# EAGLE design telecommandeB (EAGLE 8.0.2)
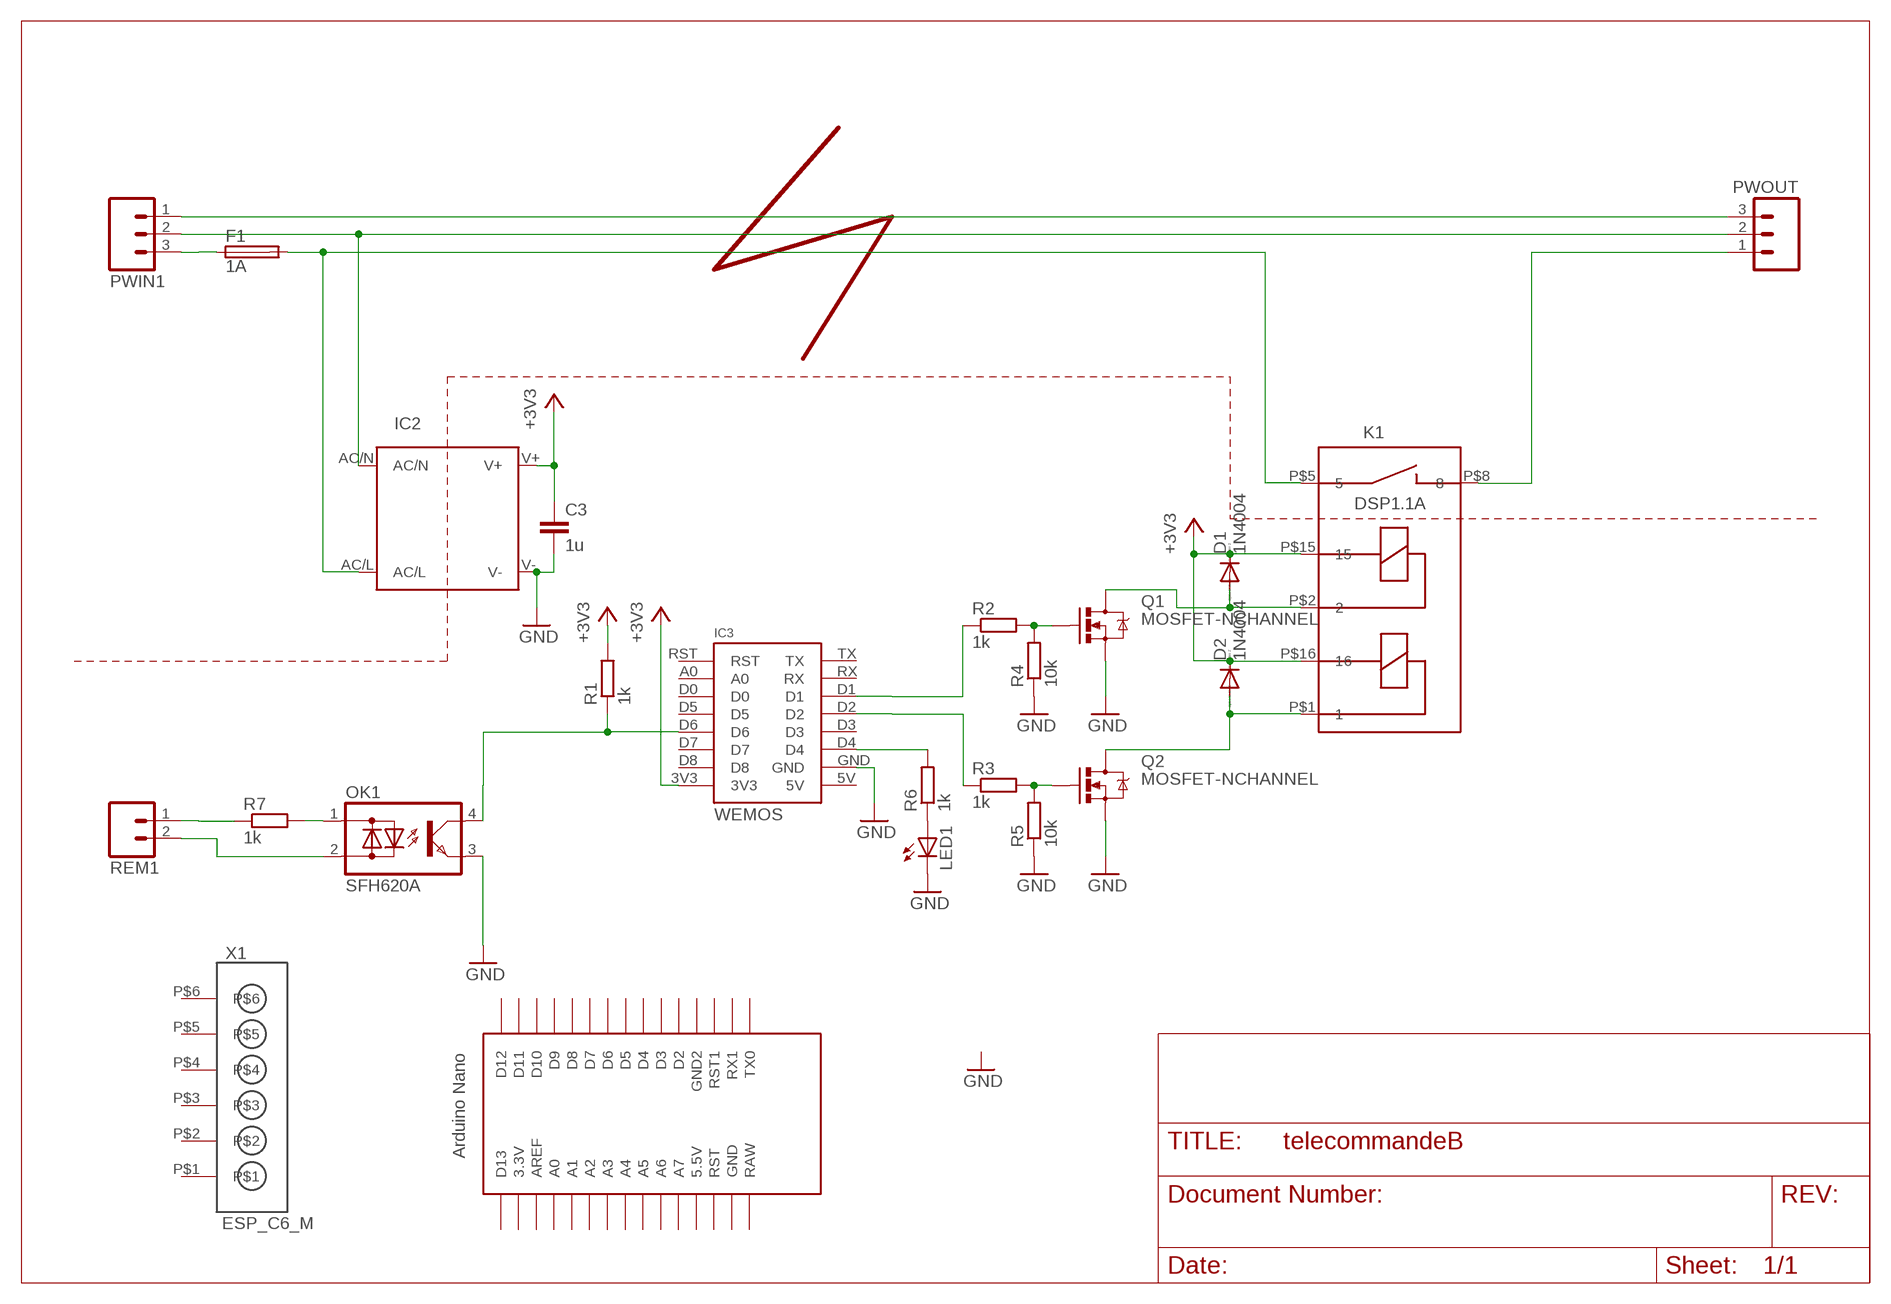
[diagram p0: schematic, sheet 1]

## Parts
C3  1u  C-EU025-024X044  [C025-024X044]
D1  1N4004  [DO41-10]
D2  1N4004  [DO41-10]
F1  1A  GSH15  [GSH15]
IC2  IRM_03  [IRM_03]
IC3  WEMOS  [WEMOS]
K1  DSP1.1A  [DSP1A]
LED1  LED3MM  [LED3MM]
OK1  SFH620A  [DIL04]
PWIN1  M03-SCREW-5MM  [SCREWTERMINAL-5MM-3]
PWOUT  M03-SCREW-5MM  [SCREWTERMINAL-5MM-3]
Q1  MOSFET-NCHANNEL  [TO-92-L]
Q2  MOSFET-NCHANNEL  [TO-92-L]
R1  1k  R-EU_0207/10  [0207/10]
R2  1k  R-EU_0204/7  [0204/7]
R3  1k  R-EU_0204/7  [0204/7]
R4  10k  R-EU_0204/7  [0204/7]
R5  10k  R-EU_0204/7  [0204/7]
R6  1k  R-EU_0204/7  [0204/7]
R7  1k  R-EU_0207/10  [0207/10]
REM1  M025MM  [SCREWTERMINAL-5MM-2]
U$1  NANO  [NANO]
X1  ESP_C6_M  [ESP-CONNECT-6]

## Nets
+3V3: C3.1 D1.C D2.C IC2.V+ IC3.3V3 K1.P$15 K1.P$16 R1.2
GND: C3.2 IC2.V- IC3.GND LED1.K(C) OK1.3(E) Q1.P$1(S) Q2.P$1(S) R4.1 R5.1
MASSE [240V]: PWIN1.1 PWOUT.3
N [240V]: IC2.AC/N PWIN1.2 PWOUT.2
N$1: Q1.P$2(G) R2.2 R4.2
N$2: Q2.P$2(G) R3.2 R5.2
N$3: D1.A K1.P$2 Q1.P$3(D)
N$4: IC3.D4 R6.2
N$6: D2.A K1.P$1 Q2.P$3(D)
N$8 [240V]: K1.P$8 PWOUT.1
N$9: R7.1 REM1.1
N$10: LED1.A R6.1
N$11: OK1.1(AC1) R7.2
N$12: IC3.D1 R2.1
N$13: IC3.D2 R3.1
N$15: OK1.2(AC2) REM1.2
N$16: IC3.D6 OK1.4(C) R1.1
P [240V]: F1.2 IC2.AC/L K1.P$5
PI [240V]: F1.1 PWIN1.3
Unconnected: IC3.5V IC3.A0 IC3.D0 IC3.D3 IC3.D5 IC3.D7 IC3.D8 IC3.RST IC3.RX IC3.TX U$1.3.3V U$1.5V(5.5V) U$1.A0 U$1.A1 U$1.A2 U$1.A3 U$1.A4 U$1.A5 U$1.A6 U$1.A7 U$1.AREF U$1.D2 U$1.D3 U$1.D4 U$1.D5 U$1.D6 U$1.D7 U$1.D8 U$1.D9 U$1.D10 U$1.D11 U$1.D12 U$1.D13 U$1.GND U$1.GND1(GND2) U$1.ICSP1 U$1.ICSP2 U$1.ICSP3 U$1.ICSP4 U$1.ICSP5 U$1.ICSP6 U$1.RAW U$1.RST U$1.RST1 U$1.RX1 U$1.TX0 X1.P$1 X1.P$2 X1.P$3 X1.P$4 X1.P$5 X1.P$6

## Library data of the parts
C3 = rcl:C-EU: CAPACITOR, European symbol
D1 D2 = diode:1N4004: DIODE general purpose rectifier, 1 A
F1 = fuse:GSH15: FUSE HOLDER grid 15mm, 19649 Wickmann; MPN: 64900001039; OC_FARNELL: 1271673; OC_NEWARK: 02P0318
IC2 = meanwell_irm_v6:IRM_03: 3 watt IRM 03 Vout [V] Imax [A] Pmax [W] Eff [%] 3.3 0.9 3 68 5 0.6 3 72 9 0.33 3 77 12 0.25 3 78 15 0.2 3 78 24 0.125 3 80
IC3 = wemos:WEMOS
K1 = nicolas:DSP1.1
LED1 = led:LED: LED OSRAM: - CHIPLED LG R971, LG N971, LY N971, LG Q971, LY Q971, LO R971, LY R971 LH N974, LH R974 LS Q976, LO Q976, LY Q976 LO Q996 - Hyper CHIPLED LW Q18S LB Q993, LB Q99A, LB R99A - SideLED LS A670, LO A670, LY A670, LG A670, LP A670 LB A673, LV A673, LT A673, LW A673 LH A674 LY A675 LS A676, LA A676, LO A676, LY A676, LW A676 LS A679, LY A679, LG A679 - Hyper Micro SIDELED® LS Y876, LA Y876, LO Y876, LY Y876 LT Y87S - SmartLED LW L88C, LW L88S LB L89C, LB L89S, LG L890 LS L89K, LO L89K, LY L89K LS L896, LA L896, LO L896, LY L896 - TOPLED LS T670, LO T670, LY T670, LG T670, LP T670 LSG T670, LSP T670, LSY T670, LOP T670, LYG T670 LG T671, LOG T671, LSG T671 LB T673, LV T673, LT T673, LW T673 LH T674 LS T676, LA T676, LO T676, LY T676, LB T676, LH T676, LSB T676, LW T676 LB T67C, LV T67C, LT T67C, LS T67K, LO T67K, LY T67K, LW E67C LS E67B, LA E67B, LO E67B, LY E67B, LB E67C, LV E67C, LT E67C LW T67C LS T679, LY T679, LG T679 LS T770, LO T770, LY T770, LG T770, LP T770 LB T773, LV T773, LT T773, LW T773 LH T774 LS E675, LA E675, LY E675, LS T675 LS T776, LA T776, LO T776, LY T776, LB T776 LHGB T686 LT T68C, LB T68C - Hyper Mini TOPLED® LB M676 - Mini TOPLED Santana® LG M470 LS M47K, LO M47K, LY M47K Source: http://www.osram.convergy.de LUXEON: - LUMILED® LXK2-PW12-R00, LXK2-PW12-S00, LXK2-PW14-U00, LXK2-PW14-V00 LXK2-PM12-R00, LXK2-PM12-S00, LXK2-PM14-U00 LXK2-PE12-Q00, LXK2-PE12-R00, LXK2-PE12-S00, LXK2-PE14-T00, LXK2-PE14-U00 LXK2-PB12-K00, LXK2-PB12-L00, LXK2-PB12-M00, LXK2-PB14-N00, LXK2-PB14-P00, LXK2-PB14-Q00 LXK2-PR12-L00, LXK2-PR12-M00, LXK2-PR14-Q00, LXK2-PR14-R00 LXK2-PD12-Q00, LXK2-PD12-R00, LXK2-PD12-S00 LXK2-PH12-R00, LXK2-PH12-S00 LXK2-PL12-P00, LXK2-PL12-Q00, LXK2-PL12-R00 Source: www.luxeon.com KINGBRIGHT: KA-3528ASYC Source: www.kingbright.com
OK1 = optocoupler:SFH620: Optocoupler, Phototransistor Output, AC Input Source: http://www.vishay.com/docs/83675/sfh620.pdf; MPN: SFH620A-2; OC_FARNELL: 1469594; OC_NEWARK: 97K9546
PWIN1 PWOUT = SparkFun-Connectors:M03: Header 3 Standard 3-pin 0.1" header. Use with straight break away headers (SKU : PRT-00116), right angle break away headers (PRT-00553), swiss pins (PRT-00743), machine pins (PRT-00117), and female headers (PRT-00115). Molex polarized connector foot print use with SKU : PRT-08232 with associated crimp pins and housings.; STOREFRONT_ID: PRT-08433
Q1 Q2 = fets:MOSFET-NCHANNEL: Generic NMOS footprint
R1-R7 = rcl:R-EU_: RESISTOR, European symbol
REM1 = SparkFun-Connectors:M02: Standard 2-pin 0.1" header. Use with - straight break away headers ( PRT-00116) - right angle break away headers (PRT-00553) - swiss pins (PRT-00743) - machine pins (PRT-00117) - female headers (PRT-00115) Molex polarized connector foot print use with: PRT-08233 with associated crimp pins and housings. 2.54_SCREWTERM for use with PRT-10571. 3.5mm Screw Terminal footprints for PRT-08084 5mm Screw Terminal footprints for use with PRT-08432; STOREFRONT_ID: PRT-08432
U$1 = Arduino-clone:NANO: Arduino Nano
X1 = nicolas:ESP_C6_M

## Net classes
0 default: width 0.61 mm, drill 0.8 mm, clearance 0.61 mm
1 240V: width 1 mm, drill 1 mm, clearance 1 mm

## Board
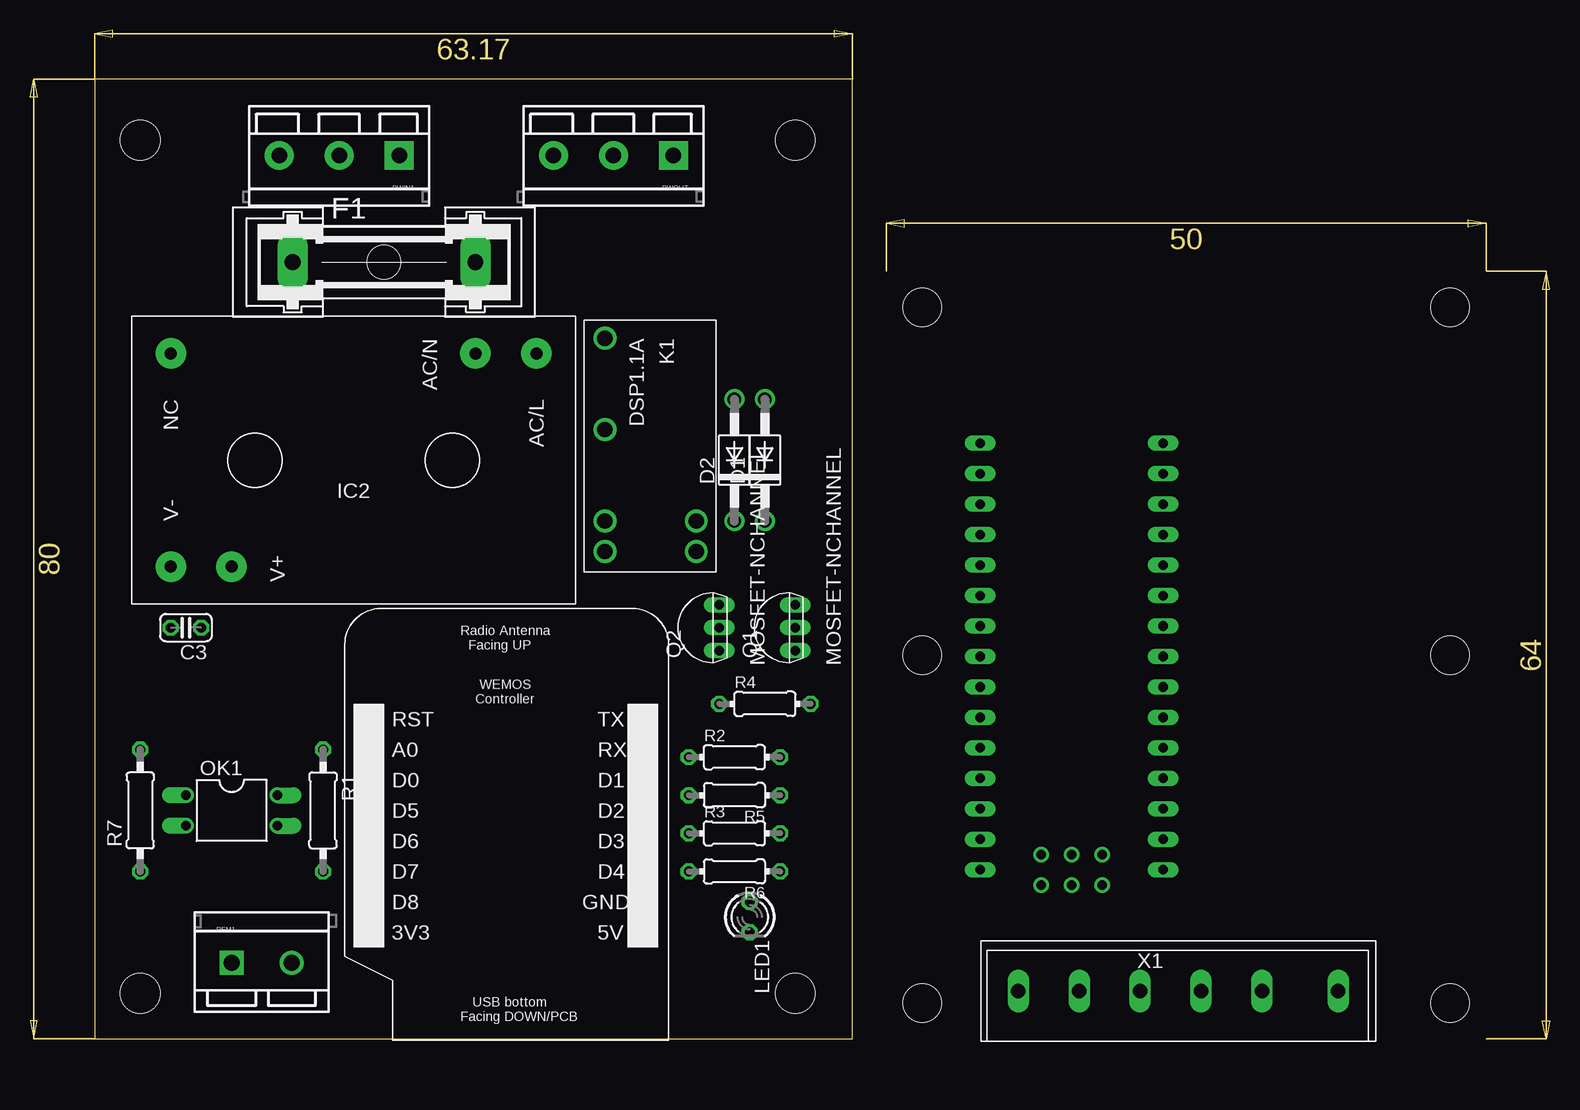
[diagram p1: board, top side]
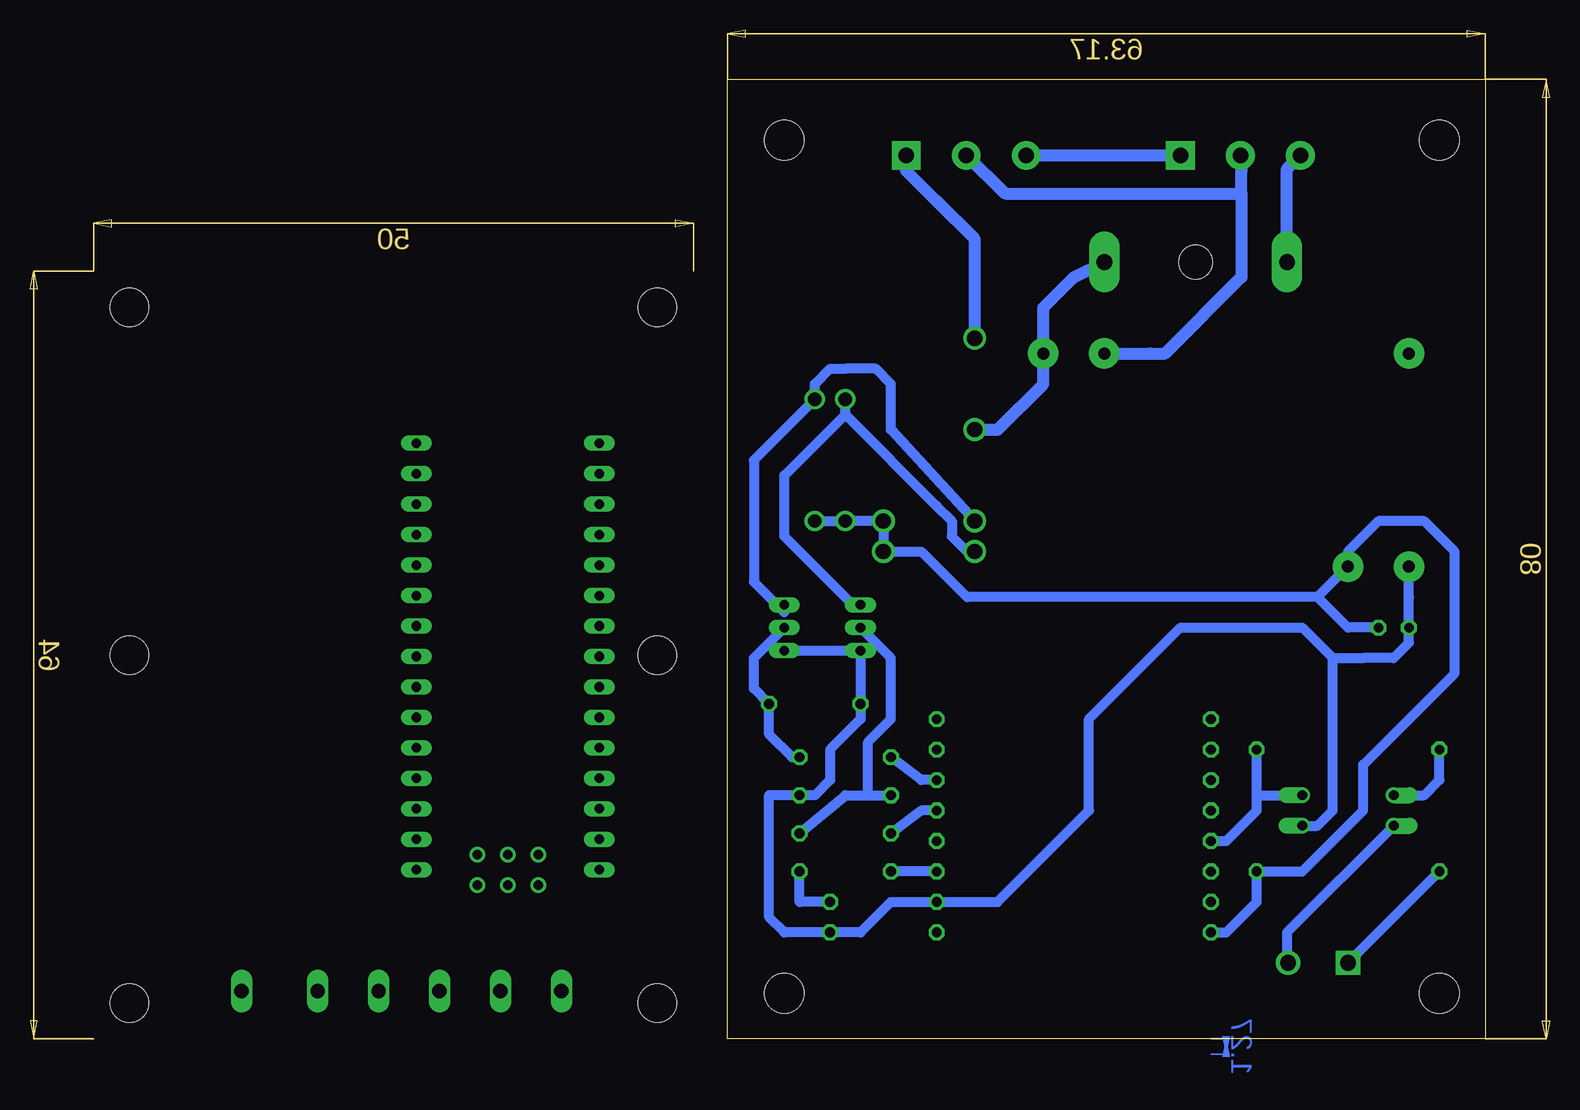
[diagram p2: board, bottom side, seen from below]

Size 63.17 x 80 mm. Coordinates in mm from the lower left corner, seen from the top.
Outline: 0,0 63.17,0 63.17,80 0,80 0,0
Copper layers (1*16): Top 0.035mm / dielectric 1.5mm / Bottom 0.035mm
Design rules "default": minimum track width 10mil, minimum drill 24mil, track to track 8mil, track to pad 8mil, pad to pad 8mil, via to via 8mil, smd to smd 8mil, copper to edge 40mil, drill to drill 8mil, minimum pad ring 10mil, minimum via ring 8mil, stop-mask expansion 4mil, vias tented up to drill 0mil, thermal gap 10mil
Holes 3.3 mm at 3.81,74.93 58.42,74.93 58.42,3.81 3.81,3.81
Holes 3.2 mm at 69,3 113,3 113,61 69,61 69,32 113,32

### Footprints (pad centres in the part's own frame; a part is rotated, then mirrored left to right if it is on the bottom)
C025-024X044 = drill 0.813 octagon: 1 -1.27,0; 2 1.27,0
DO41-10 = drill 1.118: A 5.08,0; C -5.08,0
GSH15 = drill 1.321 pad 2.54 long: 1 -7.62,0; 2 7.62,0 | hole 2.794: 0,0
IRM_03 = drill 1 pad 2.54: AC/L -15.24,-8.89; AC/N -10.16,-8.89; NC 15.24,-8.89; V+ 10.16,8.89; V- 15.24,8.89
WEMOS = drill 0.8 octagon: 3V3 0,0; 5V 22.86,0; A0 0,15.24; D0 0,12.7; D1 22.86,12.7; D2 22.86,10.16; D3 22.86,7.62; D4 22.86,5.08; D5 0,10.16; D6 0,7.62; D7 0,5.08; D8 0,2.54; GND 22.86,2.54; RST 0,17.78; RX 22.86,15.24; TX 22.86,17.78
DSP1A = drill 1.27: P$1 17.78,0; P$2 15.24,0; P$5 7.62,0; P$8 0,0; P$15 15.24,7.62; P$16 17.78,7.62
LED3MM = drill 0.813 octagon: A -1.27,0; K 1.27,0
DIL04 = drill 0.813 offset: 1 -1.27,-3.81; 2 1.27,-3.81; 3 1.27,3.81; 4 -1.27,3.81
SCREWTERMINAL-5MM-3 = drill 1.3 pad 2.413 square: 1 0,0 | drill 1.3 pad 2.413: 2 5,0; 3 10,0
TO-92-L = drill 0.8 long: P$1 -1.905,0; P$2 0,0; P$3 1.905,0
0207/10 = drill 0.813 octagon: 1 -5.08,0; 2 5.08,0
0204/7 = drill 0.813 octagon: 1 -3.81,0; 2 3.81,0
SCREWTERMINAL-5MM-2 = drill 1.3 pad 2.032 square: 1 0,0 | drill 1.3 pad 2.032: 2 5,0
NANO = drill 0.8 long: 3.3V -10.16,24.13; 5V -10.16,-1.27; A0 -10.16,19.05; A1 -10.16,16.51; A2 -10.16,13.97; A3 -10.16,11.43; A4 -10.16,8.89; A5 -10.16,6.35; A6 -10.16,3.81; A7 -10.16,1.27; AREF -10.16,21.59; D2 5.08,1.27; D3 5.08,3.81; D4 5.08,6.35; D5 5.08,8.89; D6 5.08,11.43; D7 5.08,13.97; D8 5.08,16.51; D9 5.08,19.05; D10 5.08,21.59; D11 5.08,24.13; D12 5.08,26.67; D13 -10.16,26.67; GND -10.16,-6.35; GND1 5.08,-1.27; RAW -10.16,-8.89; RST -10.16,-3.81; RST1 5.08,-3.81; RX1 5.08,-6.35; TX0 5.08,-8.89 | drill 0.8: ICSP1 -5.08,-10.16; ICSP2 -5.08,-7.62; ICSP3 -2.54,-10.16; ICSP4 -2.54,-7.62; ICSP5 0,-10.16; ICSP6 0,-7.62
ESP-CONNECT-6 = drill 1.2 long: P$1 0,0; P$2 5.08,0; P$3 10.16,0; P$4 15.24,0; P$5 20.32,0; P$6 26.67,0

### Placement (x,y rotation side)
C3  7.62,34.29 180 top
D1  55.88,48.26 90 top
D2  53.34,48.26 90 top
F1  24.13,64.77 0 top
IC2  21.59,48.26 180 top
IC3  22.86,8.89 0 top
K1  42.55,58.42 270 top
LED1  54.61,10.16 270 top
OK1  11.43,19.05 270 top
PWIN1  25.4,73.66 180 top
PWOUT  48.26,73.66 180 top
Q1  58.42,34.29 90 top
Q2  52.07,34.29 90 top
R1  19.05,19.05 270 top
R2  53.34,23.5 0 top
R3  53.34,17.14 0 top
R4  55.88,27.94 0 top
R5  53.34,20.32 180 top
R6  53.34,13.97 180 top
R7  3.81,19.05 90 top
REM1  11.43,6.35 0 top
U$1  84,23 0 top  (outside the outline)
X1  77,4 0 top  (outside the outline)

### Tracks (layer width: path | path; a pad name or v marks a point on that pad's centre or on a via)
+3V3
  Bottom 0.813: D1.C D2.C K1.P$15 K1.P$16 46.99,40.64 43.18,36.83 13.97,36.83 | IC3.3V3 21.59,8.89 19.05,11.43 R1.2 15.24,13.97 10.16,19.05 10.16,22.86 2.54,30.48 2.54,40.64 5.08,43.18 8.89,43.18 11.43,40.64 IC2.V+ 13.97,36.83 | C3.1 11.43,34.29 13.97,36.83
GND
  Bottom 0.813: IC2.V- 6.35,36.83 C3.2 6.35,33.02 7.62,31.75 10.16,31.75 | 12.7,31.75 10.16,31.75 | 12.7,31.75 15.24,34.29 25.4,34.29 33.02,26.67 33.02,19.05 40.64,11.43 IC3.GND 49.53,11.43 52.07,8.89 LED1.K 58.42,8.89 59.69,10.16 59.69,20.32 | 12.7,31.75 10.16,31.75 | OK1.3 13.97,17.78 12.7,19.05 12.7,31.75 | R5.1 59.69,20.32 | R5.1 59.69,20.32 | Q1.P$1 Q2.P$1 R4.1 52.07,26.67 54.61,24.13 54.61,21.59 55.88,20.32 R5.1
MASSE
  Bottom 1.016: PWIN1.1 PWOUT.3
N
  Bottom 1: IC2.AC/N 27.94,57.15 26.67,57.15 20.32,63.5 20.32,70.48 20.32,72.39
  Bottom 1.016: 20.32,72.39 20.32,73.11 20.4,73.19 PWIN1.2 | PWOUT.2 43.26,73.74 40.01,70.48 20.32,70.48
N$1
  Bottom 0.813: R2.2 57.78,23.5 59.69,25.4 R4.2 60.96,29.21 60.96,31.75 59.69,33.02 Q1.P$2
N$2
  Bottom 0.813: R3.2 53.34,20.32 51.44,20.32 | 51.44,20.32 R5.2 | 51.44,20.32 51.44,24.77 49.53,26.67 49.53,31.75 50.8,33.02 Q2.P$2
N$3
  Bottom 0.813: K1.P$2 49.53,50.8 49.53,54.61 50.8,55.88 53.34,55.88 54.61,55.88 55.88,54.61 D1.A 60.96,48.26 60.96,38.1 58.42,35.56 Q1.P$3
N$4
  Bottom 0.813: IC3.D4 R6.2
N$6
  Bottom 0.813: 53.34,52.07 45.72,44.45 44.45,43.18 44.45,41.91 43.18,40.64 K1.P$1 | 53.34,52.07 D2.A | 53.34,52.07 58.42,46.99 58.42,41.91 52.7,36.2 Q2.P$3
N$8
  Bottom 1: K1.P$8 42.55,66.67 45.72,69.85
  Bottom 1.016: 45.72,69.85 48.26,72.39 PWOUT.1
N$9
  Bottom 0.813: REM1.1 R7.1
N$10
  Bottom 0.813: LED1.A 57.15,11.43 R6.1
N$11
  Bottom 0.813: OK1.1 5.08,20.32 3.81,21.59 R7.2
N$12
  Bottom 0.813: IC3.D1 46.99,21.59 R2.1
N$13
  Bottom 0.813: IC3.D2 46.99,19.05 R3.1
N$15
  Bottom 0.813: OK1.2 16.51,8.89 16.51,6.43 REM1.2
N$16
  Bottom 0.813: 19.05,20.32 OK1.4 | 19.05,20.32 19.05,21.59 R1.1 | IC3.D6 21.59,16.51 19.05,19.05 19.05,20.32
P
  Bottom 1: 34.29,63.5 F1.2
  Bottom 1.016: 34.29,63.5 36.83,60.96 IC2.AC/L 36.83,54.61 40.64,50.8 K1.P$5
PI
  Bottom 1.016: F1.1 16.51,72.55 PWIN1.3
(copper drawn outside any net)
  shapes: Bottom area x1